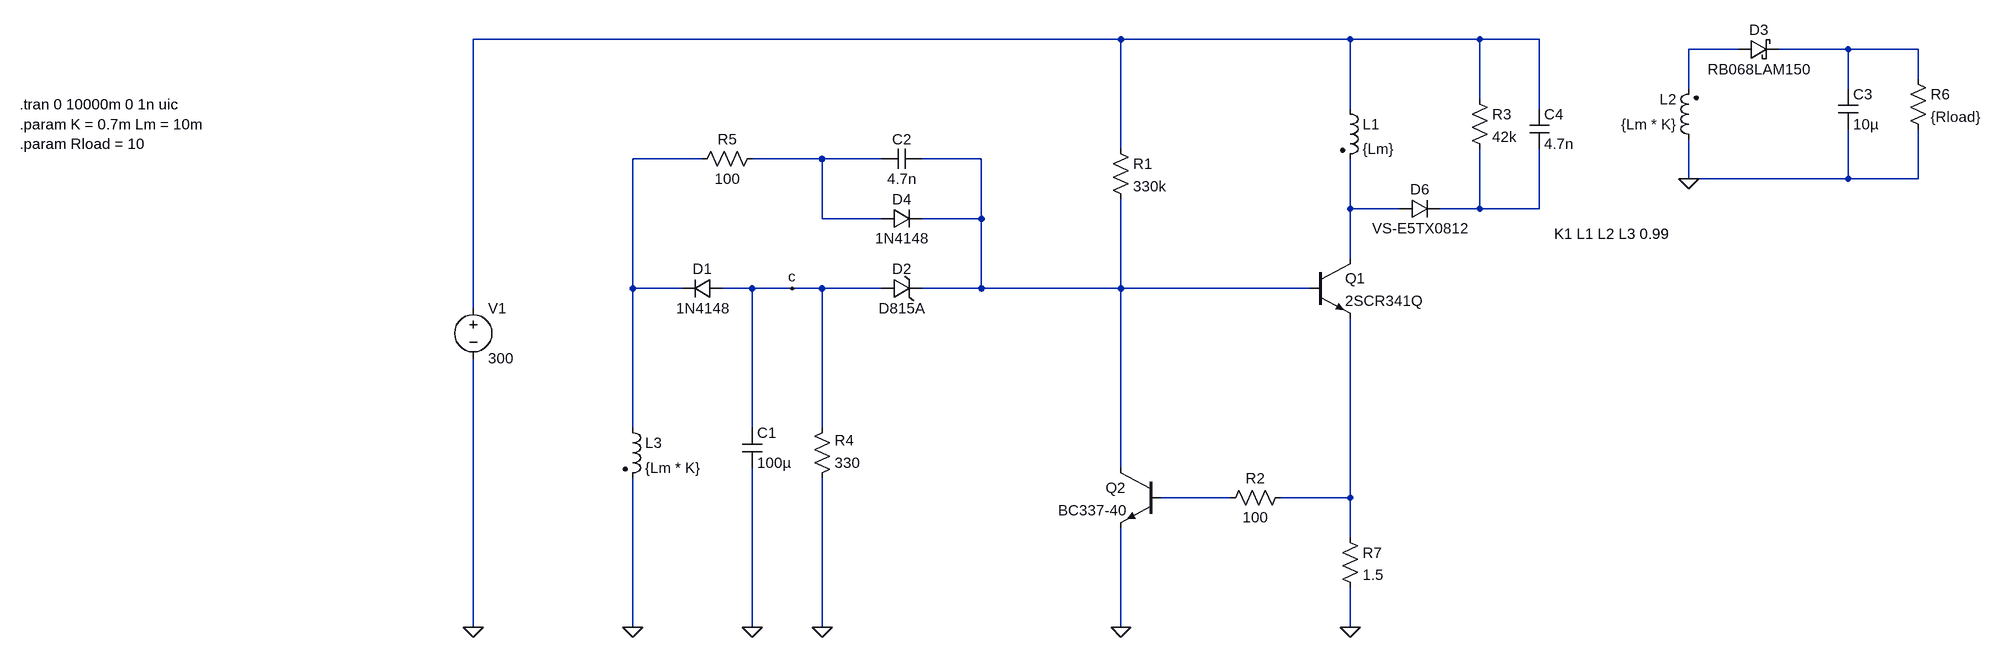
[diagram p0: schematic self-oscillating_flyback.asc]
self-oscillating_flyback.asc, the LTspice schematic file:
Version 4
SHEET 1 1924 1060
WIRE -32 -256 -1072 -256
WIRE 336 -256 -32 -256
WIRE 544 -256 336 -256
WIRE 640 -256 544 -256
WIRE 960 -240 880 -240
WIRE 1136 -240 1024 -240
WIRE 1248 -240 1136 -240
WIRE 1248 -192 1248 -240
WIRE 880 -176 880 -240
WIRE 1136 -176 1136 -240
WIRE 544 -160 544 -256
WIRE 336 -144 336 -256
WIRE 640 -144 640 -256
WIRE -32 -80 -32 -256
WIRE -704 -64 -816 -64
WIRE -512 -64 -624 -64
WIRE -416 -64 -512 -64
WIRE -256 -64 -352 -64
WIRE 880 -32 880 -96
WIRE 1136 -32 1136 -112
WIRE 1136 -32 880 -32
WIRE 1248 -32 1248 -112
WIRE 1248 -32 1136 -32
WIRE 336 16 336 -64
WIRE 416 16 336 16
WIRE 544 16 544 -80
WIRE 544 16 480 16
WIRE 640 16 640 -80
WIRE 640 16 544 16
WIRE -512 32 -512 -64
WIRE -416 32 -512 32
WIRE -256 32 -256 -64
WIRE -256 32 -352 32
WIRE 336 96 336 16
WIRE -816 144 -816 -64
WIRE -736 144 -816 144
WIRE -624 144 -672 144
WIRE -560 144 -624 144
WIRE -512 144 -560 144
WIRE -416 144 -512 144
WIRE -256 144 -256 32
WIRE -256 144 -352 144
WIRE -32 144 -32 0
WIRE -32 144 -256 144
WIRE 272 144 -32 144
WIRE -1072 176 -1072 -256
WIRE -816 368 -816 144
WIRE -624 368 -624 144
WIRE -512 368 -512 144
WIRE -32 432 -32 144
WIRE 144 480 32 480
WIRE 336 480 336 192
WIRE 336 480 224 480
WIRE 336 544 336 480
WIRE -1072 688 -1072 256
WIRE -816 688 -816 448
WIRE -624 688 -624 432
WIRE -512 688 -512 448
WIRE -32 688 -32 528
WIRE 336 688 336 624
FLAG -32 688 0
FLAG -624 688 0
FLAG -1072 688 0
FLAG 880 -32 0
FLAG -560 144 c
FLAG 336 688 0
FLAG -816 688 0
FLAG -512 688 0
SYMBOL npn 272 96 R0
SYMATTR InstName Q1
SYMATTR Value 2SCR341Q
SYMBOL res -48 -96 R0
SYMATTR InstName R1
SYMATTR Value 330k
SYMBOL npn 32 432 M0
SYMATTR InstName Q2
SYMATTR Value BC337-40
SYMBOL res 240 464 R90
WINDOW 0 0 56 VBottom 2
WINDOW 3 32 56 VTop 2
SYMATTR InstName R2
SYMATTR Value 100
SYMBOL voltage -1072 160 R0
WINDOW 123 0 0 Left 0
WINDOW 39 0 0 Left 0
SYMATTR InstName V1
SYMATTR Value 300
SYMBOL ind2 320 -160 R0
SYMATTR InstName L1
SYMATTR Value {Lm}
SYMATTR Type ind
SYMBOL ind2 896 -80 R180
WINDOW 0 36 80 Left 2
WINDOW 3 36 40 Left 2
SYMATTR InstName L2
SYMATTR Value {Lm * K}
SYMATTR Type ind
SYMBOL ind2 -832 352 R0
SYMATTR InstName L3
SYMATTR Value {Lm * K}
SYMATTR Type ind
SYMBOL diode -672 128 R90
WINDOW 0 0 32 VBottom 2
WINDOW 3 32 32 VTop 2
SYMATTR InstName D1
SYMATTR Value 1N4148
SYMBOL zener -416 160 R270
WINDOW 0 32 32 VTop 2
WINDOW 3 0 32 VBottom 2
SYMATTR InstName D2
SYMATTR Value D815A
SYMATTR Description Diode
SYMATTR Type diode
SYMBOL cap -640 368 R0
SYMATTR InstName C1
SYMATTR Value 100µ
SYMBOL cap -352 -80 R90
WINDOW 0 0 32 VBottom 2
WINDOW 3 32 32 VTop 2
SYMATTR InstName C2
SYMATTR Value 4.7n
SYMBOL res -720 -48 R270
WINDOW 0 32 56 VTop 2
WINDOW 3 0 56 VBottom 2
SYMATTR InstName R5
SYMATTR Value 100
SYMBOL res 1232 -208 R0
SYMATTR InstName R6
SYMATTR Value {Rload}
SYMBOL cap 1120 -176 R0
SYMATTR InstName C3
SYMATTR Value 10µ
SYMBOL res 320 528 R0
SYMATTR InstName R7
SYMATTR Value 1.5
SYMBOL res -528 464 M180
WINDOW 0 36 76 Left 2
WINDOW 3 36 40 Left 2
SYMATTR InstName R4
SYMATTR Value 330
SYMBOL diode -416 48 R270
WINDOW 0 32 32 VTop 2
WINDOW 3 0 32 VBottom 2
SYMATTR InstName D4
SYMATTR Value 1N4148
SYMBOL diode 416 32 R270
WINDOW 0 32 32 VTop 2
WINDOW 3 0 32 VBottom 2
SYMATTR InstName D6
SYMATTR Value VS-E5TX0812
SYMBOL cap 624 -144 R0
SYMATTR InstName C4
SYMATTR Value 4.7n
SYMBOL res 528 -176 R0
SYMATTR InstName R3
SYMATTR Value 42k
SYMBOL schottky 960 -224 R270
WINDOW 0 32 32 VTop 2
WINDOW 3 0 32 VBottom 2
SYMATTR InstName D3
SYMATTR Value RB068LAM150
SYMATTR Description Diode
SYMATTR Type diode
TEXT -1800 -152 Left 2 !.tran 0 10000m 0 1n uic
TEXT 664 56 Left 2 !K1 L1 L2 L3 0.99
TEXT -1800 -120 Left 2 !.param K = 0.7m Lm = 10m
TEXT -1800 -88 Left 2 !.param Rload = 10

The netlist it stands for:
* self-oscillating_flyback.asc
Q1 N007 N006 N010 0 2SCR341Q
R1 N001 N006 330k
Q2 N006 N009 0 0 BC337-40
R2 N010 N009 100
V1 N001 0 300
L1 N001 N007 {Lm}
L2 0 N002 {Lm * K}
L3 N004 0 {Lm * K}
D1 c N004 1N4148
D2 c N006 D815A
C1 c 0 100µ
C2 N006 N005 4.7n
R5 N004 N005 100
R6 N003 0 {Rload}
C3 N003 0 10µ
R7 N010 0 1.5
R4 0 c 330
D4 N005 N006 1N4148
D6 N007 N008 VS-E5TX0812
C4 N001 N008 4.7n
R3 N001 N008 42k
D3 N002 N003 RB068LAM150
.model D D
.lib standard.dio
.model NPN NPN
.model PNP PNP
.lib standard.bjt
.tran 0 10000m 0 1n uic
K1 L1 L2 L3 0.99
.param K = 0.7m Lm = 10m
.param Rload = 10
.backanno
.end